# EAGLE design McPiFace-RGBPanel-V1 (EAGLE 7.4.0)
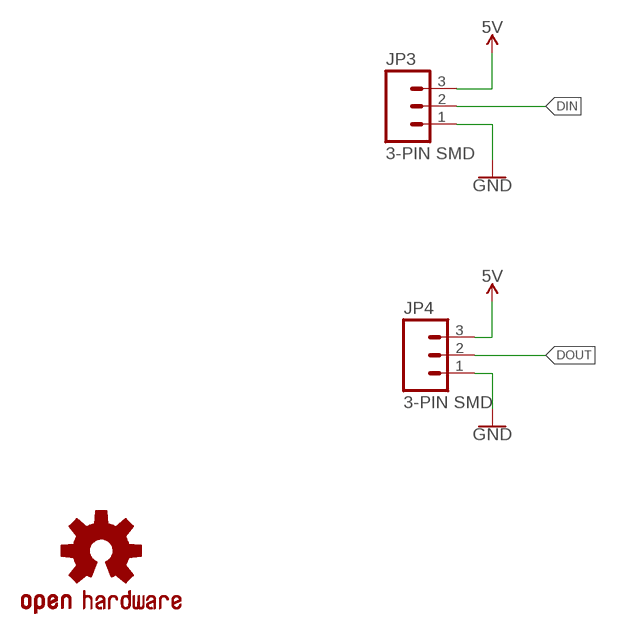
[diagram p0: schematic, sheet 1, part 1 of 2]
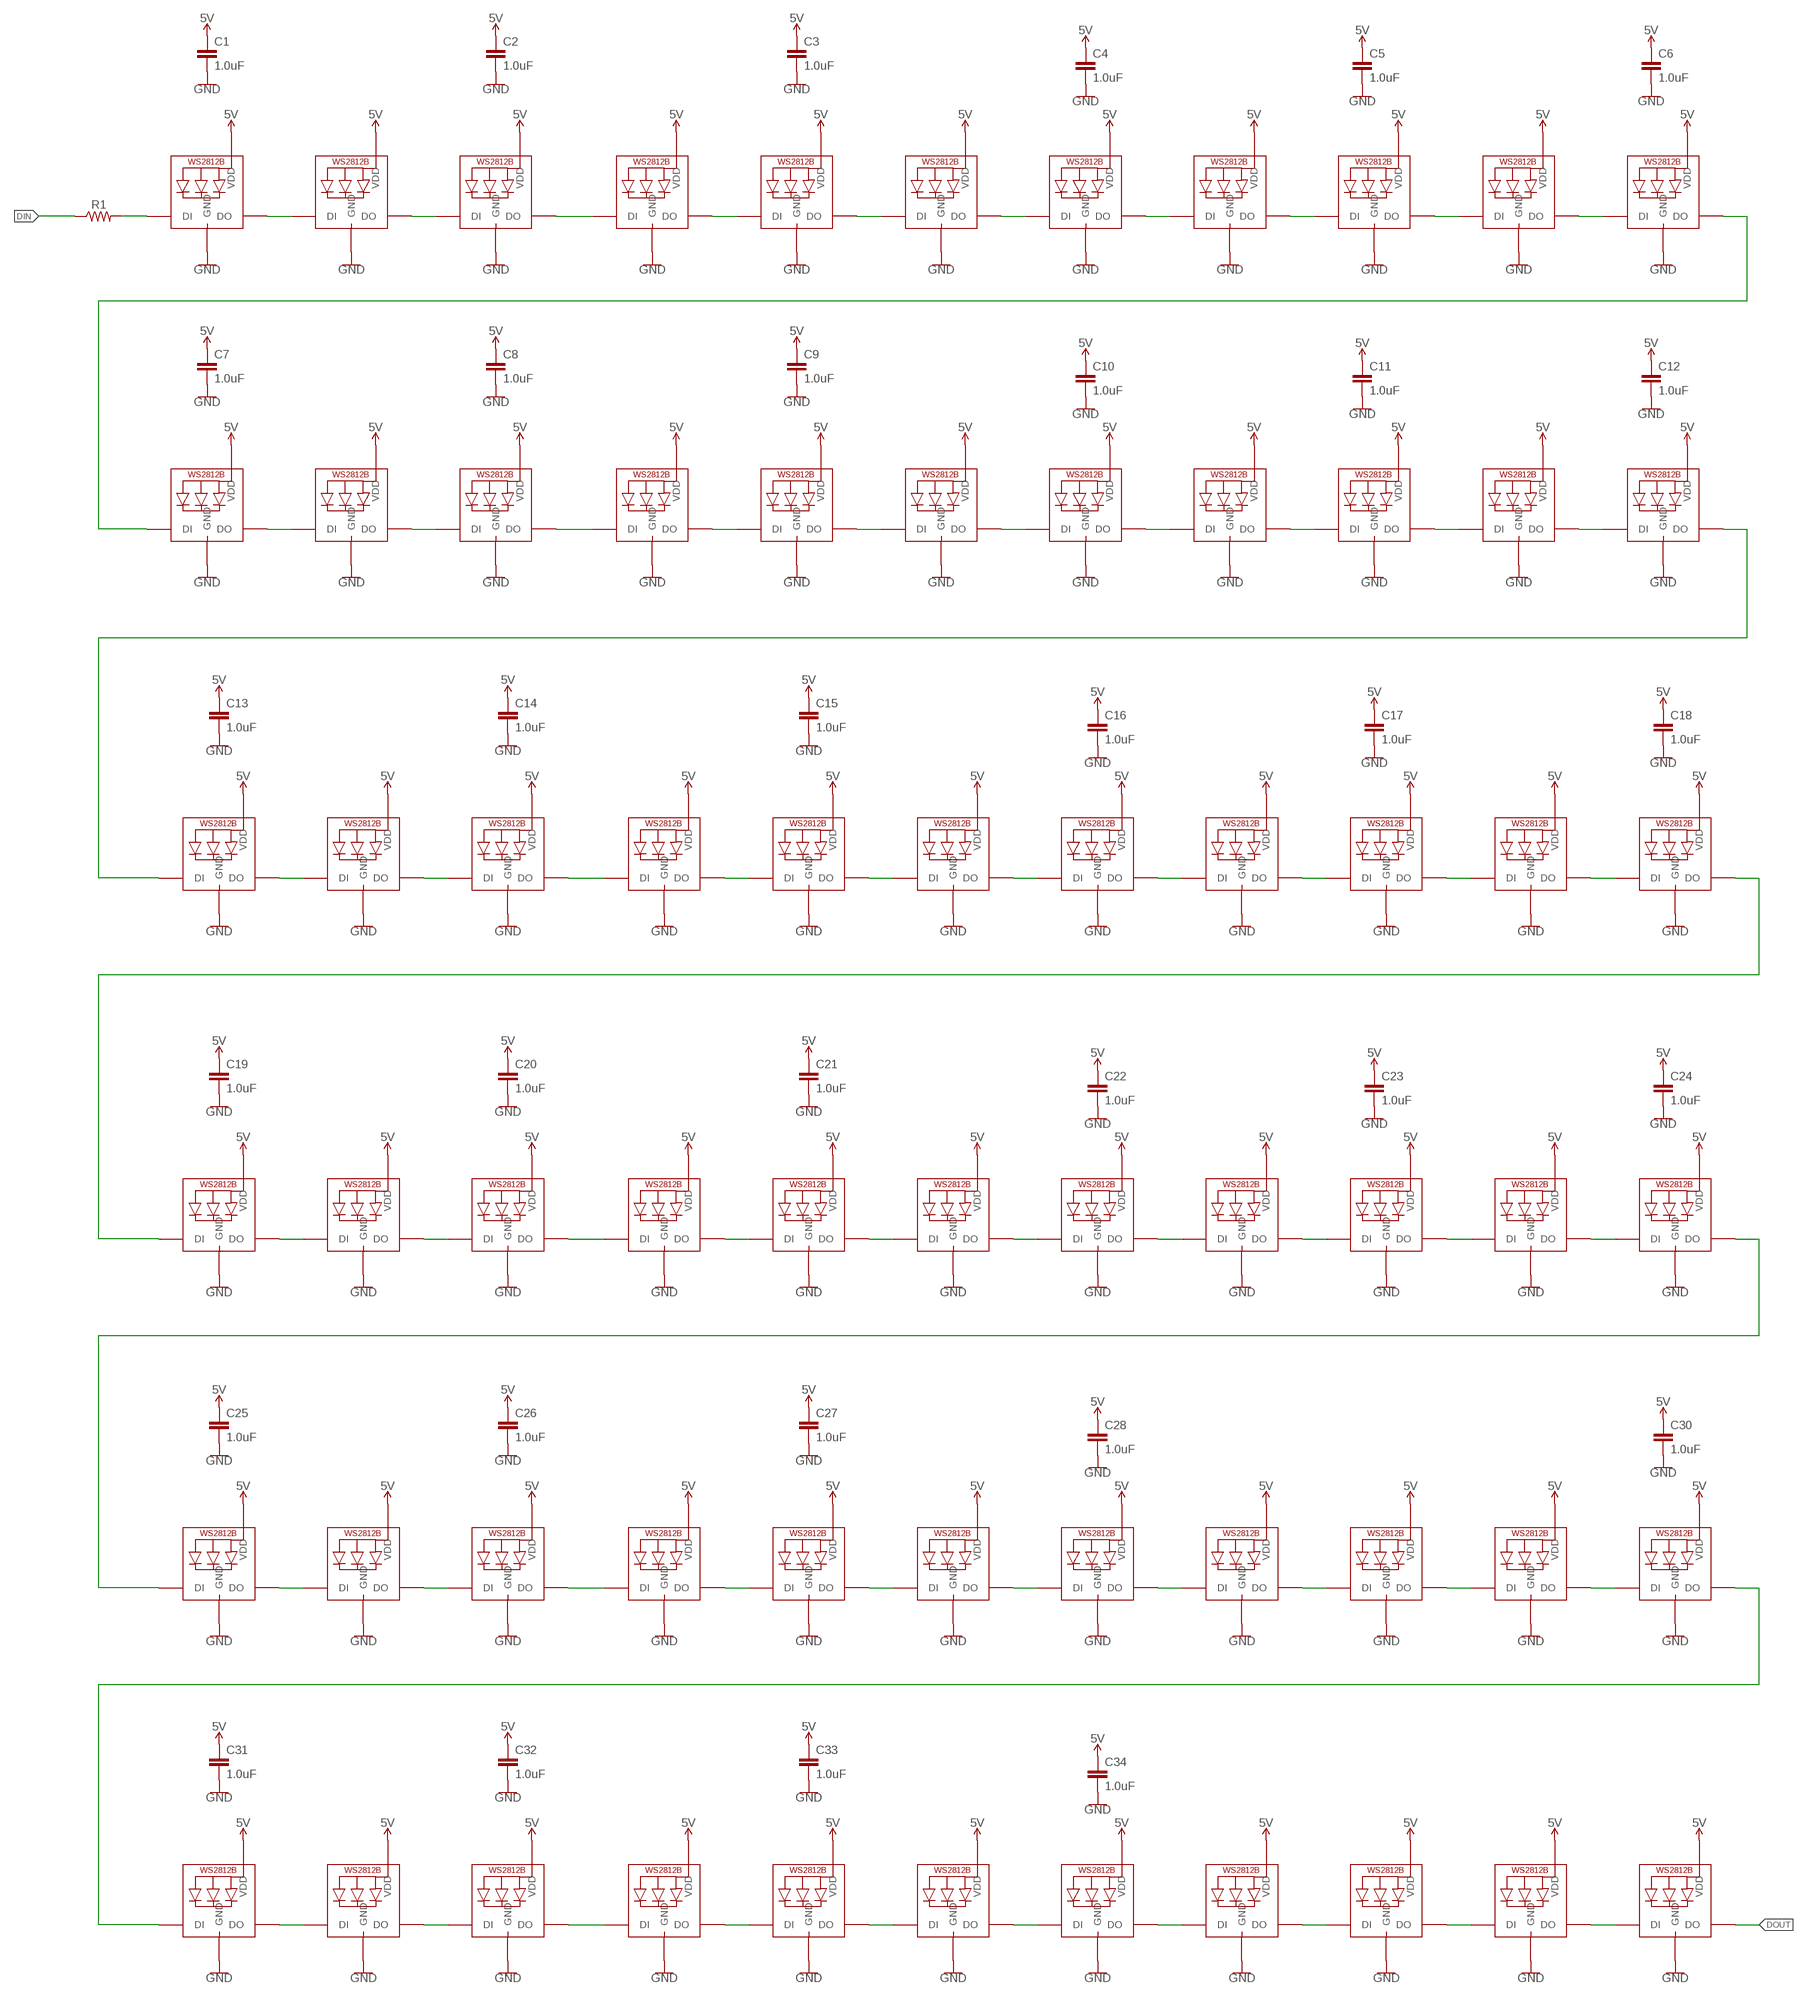
[diagram p1: schematic, sheet 1, part 2 of 2]

## Parts
C1  1.0uF  1.0UF-25V-+80/-20(0805)"  [0805-CAP]
C2  1.0uF  1.0UF-25V-+80/-20(0805)"  [0805-CAP]
C3  1.0uF  1.0UF-25V-+80/-20(0805)"  [0805-CAP]
C4  1.0uF  1.0UF-25V-+80/-20(0805)"  [0805-CAP]
C5  1.0uF  1.0UF-25V-+80/-20(0805)"  [0805-CAP]
C6  1.0uF  1.0UF-25V-+80/-20(0805)"  [0805-CAP]
C7  1.0uF  1.0UF-25V-+80/-20(0805)"  [0805-CAP]
C8  1.0uF  1.0UF-25V-+80/-20(0805)"  [0805-CAP]
C9  1.0uF  1.0UF-25V-+80/-20(0805)"  [0805-CAP]
C10  1.0uF  1.0UF-25V-+80/-20(0805)"  [0805-CAP]
C11  1.0uF  1.0UF-25V-+80/-20(0805)"  [0805-CAP]
C12  1.0uF  1.0UF-25V-+80/-20(0805)"  [0805-CAP]
C13  1.0uF  1.0UF-25V-+80/-20(0805)"  [0805-CAP]
C14  1.0uF  1.0UF-25V-+80/-20(0805)"  [0805-CAP]
C15  1.0uF  1.0UF-25V-+80/-20(0805)"  [0805-CAP]
C16  1.0uF  1.0UF-25V-+80/-20(0805)"  [0805-CAP]
C17  1.0uF  1.0UF-25V-+80/-20(0805)"  [0805-CAP]
C18  1.0uF  1.0UF-25V-+80/-20(0805)"  [0805-CAP]
C19  1.0uF  1.0UF-25V-+80/-20(0805)"  [0805-CAP]
C20  1.0uF  1.0UF-25V-+80/-20(0805)"  [0805-CAP]
C21  1.0uF  1.0UF-25V-+80/-20(0805)"  [0805-CAP]
C22  1.0uF  1.0UF-25V-+80/-20(0805)"  [0805-CAP]
C23  1.0uF  1.0UF-25V-+80/-20(0805)"  [0805-CAP]
C24  1.0uF  1.0UF-25V-+80/-20(0805)"  [0805-CAP]
C25  1.0uF  1.0UF-25V-+80/-20(0805)"  [0805-CAP]
C26  1.0uF  1.0UF-25V-+80/-20(0805)"  [0805-CAP]
C27  1.0uF  1.0UF-25V-+80/-20(0805)"  [0805-CAP]
C28  1.0uF  1.0UF-25V-+80/-20(0805)"  [0805-CAP]
C30  1.0uF  1.0UF-25V-+80/-20(0805)"  [0805-CAP]
C31  1.0uF  1.0UF-25V-+80/-20(0805)"  [0805-CAP]
C32  1.0uF  1.0UF-25V-+80/-20(0805)"  [0805-CAP]
C33  1.0uF  1.0UF-25V-+80/-20(0805)"  [0805-CAP]
C34  1.0uF  1.0UF-25V-+80/-20(0805)"  [0805-CAP]
JP3  3-PIN SMD  M03JST-SMD  [JST-3-SMD]
JP4  3-PIN SMD  M03JST-SMD  [JST-3-SMD]
LED1  WS2812B5050  [WS2812B]
LED2  WS2812B5050  [WS2812B]
LED3  WS2812B5050  [WS2812B]
LED4  WS2812B5050  [WS2812B]
LED5  WS2812B5050  [WS2812B]
LED6  WS2812B5050  [WS2812B]
LED7  WS2812B5050  [WS2812B]
LED8  WS2812B5050  [WS2812B]
LED9  WS2812B5050  [WS2812B]
LED10  WS2812B5050  [WS2812B]
LED11  WS2812B5050  [WS2812B]
LED12  WS2812B5050  [WS2812B]
LED13  WS2812B5050  [WS2812B]
LED14  WS2812B5050  [WS2812B]
LED15  WS2812B5050  [WS2812B]
LED16  WS2812B5050  [WS2812B]
LED17  WS2812B5050  [WS2812B]
LED18  WS2812B5050  [WS2812B]
LED19  WS2812B5050  [WS2812B]
LED20  WS2812B5050  [WS2812B]
LED21  WS2812B5050  [WS2812B]
LED22  WS2812B5050  [WS2812B]
LED23  WS2812B5050  [WS2812B]
LED24  WS2812B5050  [WS2812B]
LED25  WS2812B5050  [WS2812B]
LED26  WS2812B5050  [WS2812B]
LED27  WS2812B5050  [WS2812B]
LED28  WS2812B5050  [WS2812B]
LED29  WS2812B5050  [WS2812B]
LED30  WS2812B5050  [WS2812B]
LED31  WS2812B5050  [WS2812B]
LED32  WS2812B5050  [WS2812B]
LED33  WS2812B5050  [WS2812B]
LED34  WS2812B5050  [WS2812B]
LED35  WS2812B5050  [WS2812B]
LED36  WS2812B5050  [WS2812B]
LED37  WS2812B5050  [WS2812B]
LED38  WS2812B5050  [WS2812B]
LED39  WS2812B5050  [WS2812B]
LED40  WS2812B5050  [WS2812B]
LED41  WS2812B5050  [WS2812B]
LED42  WS2812B5050  [WS2812B]
LED43  WS2812B5050  [WS2812B]
LED44  WS2812B5050  [WS2812B]
LED45  WS2812B5050  [WS2812B]
LED46  WS2812B5050  [WS2812B]
LED47  WS2812B5050  [WS2812B]
LED48  WS2812B5050  [WS2812B]
LED49  WS2812B5050  [WS2812B]
LED50  WS2812B5050  [WS2812B]
LED51  WS2812B5050  [WS2812B]
LED52  WS2812B5050  [WS2812B]
LED53  WS2812B5050  [WS2812B]
LED54  WS2812B5050  [WS2812B]
LED55  WS2812B5050  [WS2812B]
LED56  WS2812B5050  [WS2812B]
LED57  WS2812B5050  [WS2812B]
LED58  WS2812B5050  [WS2812B]
LED59  WS2812B5050  [WS2812B]
LED60  WS2812B5050  [WS2812B]
LED61  WS2812B5050  [WS2812B]
LED62  WS2812B5050  [WS2812B]
LED63  WS2812B5050  [WS2812B]
LED64  WS2812B5050  [WS2812B]
LED65  WS2812B5050  [WS2812B]
LED66  WS2812B5050  [WS2812B]
LOGO1  OSHW-LOGOL  [OSHW-LOGO-L]
R1  RESISTOR0805  [0805]

## Nets
5V: C1.1 C2.1 C3.1 C4.1 C5.1 C6.1 C7.1 C8.1 C9.1 C10.1 C11.1 C12.1 C13.1 C14.1 C15.1 C16.1 C17.1 C18.1 C19.1 C20.1 C21.1 C22.1 C23.1 C24.1 C25.1 C26.1 C27.1 C28.1 C30.1 C31.1 C32.1 C33.1 C34.1 JP3.3 JP4.3 LED1.1-VDD(VDD) LED2.1-VDD(VDD) LED3.1-VDD(VDD) LED4.1-VDD(VDD) LED5.1-VDD(VDD) LED6.1-VDD(VDD) LED7.1-VDD(VDD) LED8.1-VDD(VDD) LED9.1-VDD(VDD) LED10.1-VDD(VDD) LED11.1-VDD(VDD) LED12.1-VDD(VDD) LED13.1-VDD(VDD) LED14.1-VDD(VDD) LED15.1-VDD(VDD) LED16.1-VDD(VDD) LED17.1-VDD(VDD) LED18.1-VDD(VDD) LED19.1-VDD(VDD) LED20.1-VDD(VDD) LED21.1-VDD(VDD) LED22.1-VDD(VDD) LED23.1-VDD(VDD) LED24.1-VDD(VDD) LED25.1-VDD(VDD) LED26.1-VDD(VDD) LED27.1-VDD(VDD) LED28.1-VDD(VDD) LED29.1-VDD(VDD) LED30.1-VDD(VDD) LED31.1-VDD(VDD) LED32.1-VDD(VDD) LED33.1-VDD(VDD) LED34.1-VDD(VDD) LED35.1-VDD(VDD) LED36.1-VDD(VDD) LED37.1-VDD(VDD) LED38.1-VDD(VDD) LED39.1-VDD(VDD) LED40.1-VDD(VDD) LED41.1-VDD(VDD) LED42.1-VDD(VDD) LED43.1-VDD(VDD) LED44.1-VDD(VDD) LED45.1-VDD(VDD) LED46.1-VDD(VDD) LED47.1-VDD(VDD) LED48.1-VDD(VDD) LED49.1-VDD(VDD) LED50.1-VDD(VDD) LED51.1-VDD(VDD) LED52.1-VDD(VDD) LED53.1-VDD(VDD) LED54.1-VDD(VDD) LED55.1-VDD(VDD) LED56.1-VDD(VDD) LED57.1-VDD(VDD) LED58.1-VDD(VDD) LED59.1-VDD(VDD) LED60.1-VDD(VDD) LED61.1-VDD(VDD) LED62.1-VDD(VDD) LED63.1-VDD(VDD) LED64.1-VDD(VDD) LED65.1-VDD(VDD) LED66.1-VDD(VDD)
DIN: JP3.2 R1.1
DOUT: JP4.2 LED66.2-DOUT(DO)
GND: C1.2 C2.2 C3.2 C4.2 C5.2 C6.2 C7.2 C8.2 C9.2 C10.2 C11.2 C12.2 C13.2 C14.2 C15.2 C16.2 C17.2 C18.2 C19.2 C20.2 C21.2 C22.2 C23.2 C24.2 C25.2 C26.2 C27.2 C28.2 C30.2 C31.2 C32.2 C33.2 C34.2 JP3.1 JP4.1 LED1.3-GND(GND) LED2.3-GND(GND) LED3.3-GND(GND) LED4.3-GND(GND) LED5.3-GND(GND) LED6.3-GND(GND) LED7.3-GND(GND) LED8.3-GND(GND) LED9.3-GND(GND) LED10.3-GND(GND) LED11.3-GND(GND) LED12.3-GND(GND) LED13.3-GND(GND) LED14.3-GND(GND) LED15.3-GND(GND) LED16.3-GND(GND) LED17.3-GND(GND) LED18.3-GND(GND) LED19.3-GND(GND) LED20.3-GND(GND) LED21.3-GND(GND) LED22.3-GND(GND) LED23.3-GND(GND) LED24.3-GND(GND) LED25.3-GND(GND) LED26.3-GND(GND) LED27.3-GND(GND) LED28.3-GND(GND) LED29.3-GND(GND) LED30.3-GND(GND) LED31.3-GND(GND) LED32.3-GND(GND) LED33.3-GND(GND) LED34.3-GND(GND) LED35.3-GND(GND) LED36.3-GND(GND) LED37.3-GND(GND) LED38.3-GND(GND) LED39.3-GND(GND) LED40.3-GND(GND) LED41.3-GND(GND) LED42.3-GND(GND) LED43.3-GND(GND) LED44.3-GND(GND) LED45.3-GND(GND) LED46.3-GND(GND) LED47.3-GND(GND) LED48.3-GND(GND) LED49.3-GND(GND) LED50.3-GND(GND) LED51.3-GND(GND) LED52.3-GND(GND) LED53.3-GND(GND) LED54.3-GND(GND) LED55.3-GND(GND) LED56.3-GND(GND) LED57.3-GND(GND) LED58.3-GND(GND) LED59.3-GND(GND) LED60.3-GND(GND) LED61.3-GND(GND) LED62.3-GND(GND) LED63.3-GND(GND) LED64.3-GND(GND) LED65.3-GND(GND) LED66.3-GND(GND)
N$1: LED1.2-DOUT(DO) LED2.4-DIN(DI)
N$2: LED11.2-DOUT(DO) LED12.4-DIN(DI)
N$3: LED12.2-DOUT(DO) LED13.4-DIN(DI)
N$4: LED13.2-DOUT(DO) LED14.4-DIN(DI)
N$5: LED1.4-DIN(DI) R1.2
N$6: LED14.2-DOUT(DO) LED15.4-DIN(DI)
N$7: LED15.2-DOUT(DO) LED16.4-DIN(DI)
N$8: LED2.2-DOUT(DO) LED3.4-DIN(DI)
N$9: LED3.2-DOUT(DO) LED4.4-DIN(DI)
N$10: LED16.2-DOUT(DO) LED17.4-DIN(DI)
N$11: LED4.2-DOUT(DO) LED5.4-DIN(DI)
N$12: LED5.2-DOUT(DO) LED6.4-DIN(DI)
N$13: LED6.2-DOUT(DO) LED7.4-DIN(DI)
N$14: LED7.2-DOUT(DO) LED8.4-DIN(DI)
N$15: LED8.2-DOUT(DO) LED9.4-DIN(DI)
N$16: LED9.2-DOUT(DO) LED10.4-DIN(DI)
N$17: LED10.2-DOUT(DO) LED11.4-DIN(DI)
N$18: LED17.2-DOUT(DO) LED18.4-DIN(DI)
N$19: LED18.2-DOUT(DO) LED19.4-DIN(DI)
N$20: LED19.2-DOUT(DO) LED20.4-DIN(DI)
N$21: LED20.2-DOUT(DO) LED21.4-DIN(DI)
N$22: LED21.2-DOUT(DO) LED22.4-DIN(DI)
N$24: LED22.2-DOUT(DO) LED23.4-DIN(DI)
N$25: LED23.2-DOUT(DO) LED24.4-DIN(DI)
N$26: LED24.2-DOUT(DO) LED25.4-DIN(DI)
N$27: LED25.2-DOUT(DO) LED26.4-DIN(DI)
N$28: LED26.2-DOUT(DO) LED27.4-DIN(DI)
N$29: LED27.2-DOUT(DO) LED28.4-DIN(DI)
N$30: LED28.2-DOUT(DO) LED29.4-DIN(DI)
N$31: LED29.2-DOUT(DO) LED30.4-DIN(DI)
N$32: LED30.2-DOUT(DO) LED31.4-DIN(DI)
N$33: LED31.2-DOUT(DO) LED32.4-DIN(DI)
N$34: LED32.2-DOUT(DO) LED33.4-DIN(DI)
N$35: LED33.2-DOUT(DO) LED34.4-DIN(DI)
N$37: LED34.2-DOUT(DO) LED35.4-DIN(DI)
N$38: LED35.2-DOUT(DO) LED36.4-DIN(DI)
N$39: LED36.2-DOUT(DO) LED37.4-DIN(DI)
N$40: LED37.2-DOUT(DO) LED38.4-DIN(DI)
N$41: LED38.2-DOUT(DO) LED39.4-DIN(DI)
N$42: LED39.2-DOUT(DO) LED40.4-DIN(DI)
N$43: LED40.2-DOUT(DO) LED41.4-DIN(DI)
N$44: LED41.2-DOUT(DO) LED42.4-DIN(DI)
N$45: LED42.2-DOUT(DO) LED43.4-DIN(DI)
N$46: LED43.2-DOUT(DO) LED44.4-DIN(DI)
N$49: LED44.2-DOUT(DO) LED45.4-DIN(DI)
N$50: LED45.2-DOUT(DO) LED46.4-DIN(DI)
N$51: LED46.2-DOUT(DO) LED47.4-DIN(DI)
N$52: LED47.2-DOUT(DO) LED48.4-DIN(DI)
N$53: LED48.2-DOUT(DO) LED49.4-DIN(DI)
N$54: LED49.2-DOUT(DO) LED50.4-DIN(DI)
N$55: LED50.2-DOUT(DO) LED51.4-DIN(DI)
N$56: LED51.2-DOUT(DO) LED52.4-DIN(DI)
N$57: LED52.2-DOUT(DO) LED53.4-DIN(DI)
N$58: LED53.2-DOUT(DO) LED54.4-DIN(DI)
N$59: LED54.2-DOUT(DO) LED55.4-DIN(DI)
N$61: LED55.2-DOUT(DO) LED56.4-DIN(DI)
N$62: LED56.2-DOUT(DO) LED57.4-DIN(DI)
N$63: LED57.2-DOUT(DO) LED58.4-DIN(DI)
N$64: LED58.2-DOUT(DO) LED59.4-DIN(DI)
N$65: LED59.2-DOUT(DO) LED60.4-DIN(DI)
N$66: LED60.2-DOUT(DO) LED61.4-DIN(DI)
N$67: LED61.2-DOUT(DO) LED62.4-DIN(DI)
N$68: LED62.2-DOUT(DO) LED63.4-DIN(DI)
N$69: LED63.2-DOUT(DO) LED64.4-DIN(DI)
N$70: LED64.2-DOUT(DO) LED65.4-DIN(DI)
N$71: LED65.2-DOUT(DO) LED66.4-DIN(DI)

## Library data of the parts
C1-C28 C30-C34 = SparkFun-Capacitors:1.0UF-25V-+80/-20(0805): CAP-11625; PROD_ID: CAP-11625
JP3 JP4 = SparkFun-Connectors:M03: Header 3 Standard 3-pin 0.1" header. Use with straight break away headers (SKU : PRT-00116), right angle break away headers (PRT-00553), swiss pins (PRT-00743), machine pins (PRT-00117), and female headers (PRT-00115). Molex polarized connector foot print use with SKU : PRT-08232 with associated crimp pins and housings.; PROD_ID: CONN-12591
LED1-LED66 = ThingySticks:WS2812B
LOGO1 = SparkFun-Aesthetics:OSHW-LOGO: Open-Source Hardware (OSHW) Logo This logo indicates the piece of hardware it is found on incorporates a OSHW license and/or adheres to the definition of open source hardware found here: http://freedomdefined.org/OSHW
R1 = SparkFun-Resistors:RESISTOR: Generic Resistor Package

## Board
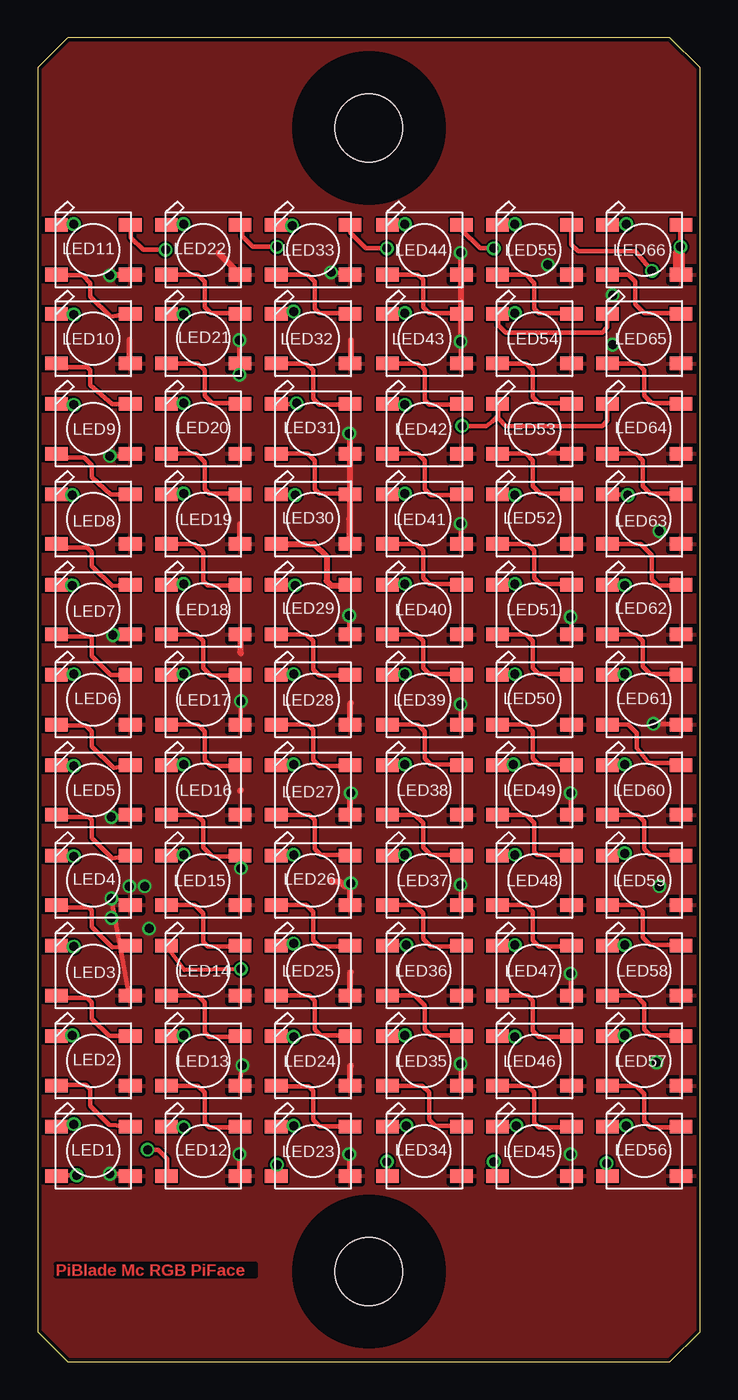
[diagram p2: board, top side]
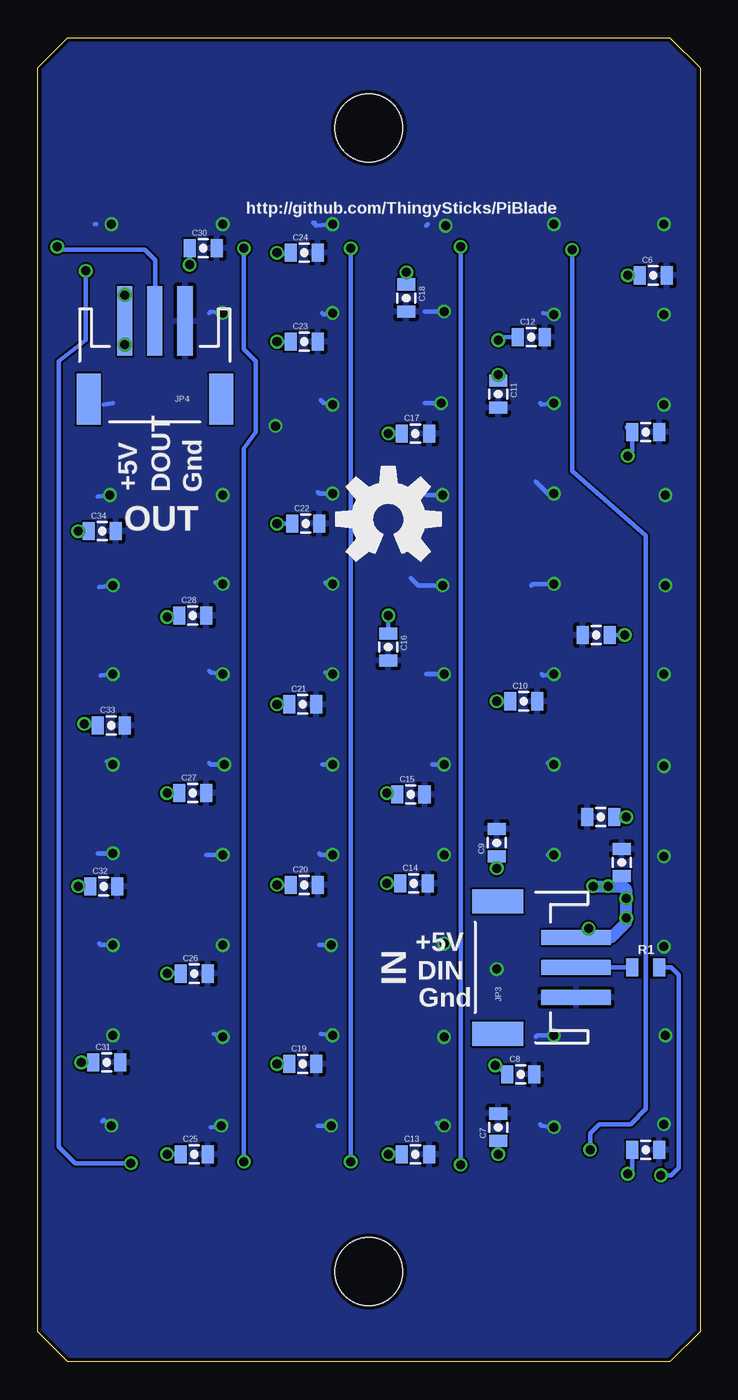
[diagram p3: board, bottom side, seen from below]

Size 44 x 88 mm. Coordinates in mm from the lower left corner, seen from the top.
Outline: 2,0 42,0 44,2 44,86 42,88 2,88 0,86 0,2 2,0
Copper layers (1*16): Top 0.035mm / dielectric 1.5mm / Bottom 0.035mm
Design rules "dirt_cheap_dirty_boards.v1": minimum track width 5mil, minimum drill 12mil, track to track 5mil, track to pad 5mil, pad to pad 5mil, via to via 5mil, smd to smd 0mil, copper to edge 10mil, drill to drill 10mil, minimum pad ring 10mil, minimum via ring 6mil, stop-mask expansion 2mil, vias tented up to drill 25mil, thermal gap 10mil
Holes 4.5 mm at 22,6 22,82
tRestrict: area 17,77 to 27,87; area 17,1 to 27,11

### Footprints (pad centres in the part's own frame; a part is rotated, then mirrored left to right if it is on the bottom)
0805-CAP = smd 0.8 x 1.2: 1 -0.9,0; 2 0.9,0
JST-3-SMD = smd 1 x 4.6: 1 -1.99,-4.77; 2 0.01,-4.77; 3 2.01,-4.77 | smd 1.6 x 3.4: NC1 -4.39,0.43; NC2 4.41,0.43
WS2812B = smd 1.5 x 0.9: 1-VDD 2.45,-1.65; 2-DOUT 2.45,1.65; 3-GND -2.45,1.65; 4-DIN -2.45,-1.65
0805 = smd 0.8 x 1.2: 1 -0.9,0; 2 0.9,0

### Placement (x,y rotation side)
C1  3.6,14.1 0 bottom
C2  5.2,33.2 90 bottom
C3  6.6,36.2 180 bottom
C4  6.9,48.3 180 bottom
C5  3.6,61.8 0 bottom
C6  3.1,72.2 0 bottom
C7  13.4,15.6 90 bottom
C8  11.9,19.1 0 bottom
C9  13.5,34.5 90 bottom
C10  11.7,43.9 0 bottom
C11  13.4,64.3 270 bottom
C12  11.2,68.1 0 bottom
C13  18.9,13.8 0 bottom
C14  19,31.8 0 bottom
C15  19.2,37.7 0 bottom
C16  20.7,47.5 270 bottom
C17  18.9,61.7 0 bottom
C18  19.5,70.7 270 bottom
C19  26.4,19.8 0 bottom
C20  26.3,31.7 0 bottom
C21  26.4,43.7 0 bottom
C22  26.2,55.7 0 bottom
C23  26.3,67.8 0 bottom
C24  26.3,73.7 0 bottom
C25  33.6,13.8 0 bottom
C26  33.6,25.8 0 bottom
C27  33.7,37.8 0 bottom
C28  33.7,49.6 0 bottom
C30  33,74 0 bottom
C31  39.4,19.9 0 bottom
C32  39.6,31.6 0 bottom
C33  39.1,42.3 0 bottom
C34  39.7,55.2 0 bottom
JP3  13,26.2 90 bottom
JP4  36.2,64.4 180 bottom
LED1  3.7,14 0 top
LED2  3.7,20 0 top
LED3  3.7,26 0 top
LED4  3.7,32 0 top
LED5  3.7,38 0 top
LED6  3.7,44 0 top
LED7  3.7,50 0 top
LED8  3.7,56 0 top
LED9  3.7,62 0 top
LED10  3.7,68 0 top
LED11  3.7,73.9 0 top
LED12  11,14 0 top
LED13  11,20 0 top
LED14  11,26 0 top
LED15  11,32 0 top
LED16  11,38 0 top
LED17  11,44 0 top
LED18  11,50 0 top
LED19  11,56 0 top
LED20  11,62 0 top
LED21  11,68 0 top
LED22  11,73.9 0 top
LED23  18.3,14 0 top
LED24  18.3,20 0 top
LED25  18.3,26 0 top
LED26  18.3,32 0 top
LED27  18.3,38 0 top
LED28  18.3,44 0 top
LED29  18.3,50 0 top
LED30  18.3,56 0 top
LED31  18.3,62 0 top
LED32  18.3,68 0 top
LED33  18.3,73.9 0 top
LED34  25.7,14 0 top
LED35  25.7,20 0 top
LED36  25.7,26 0 top
LED37  25.7,32 0 top
LED38  25.7,38 0 top
LED39  25.7,44 0 top
LED40  25.7,50 0 top
LED41  25.7,56 0 top
LED42  25.7,62 0 top
LED43  25.7,68 0 top
LED44  25.7,73.9 0 top
LED45  33,14 0 top
LED46  33,20 0 top
LED47  33,26 0 top
LED48  33,32 0 top
LED49  33,38 0 top
LED50  33,44 0 top
LED51  33,50 0 top
LED52  33,56 0 top
LED53  33,62 0 top
LED54  33,68 0 top
LED55  33,73.9 0 top
LED56  40.3,14 0 top
LED57  40.3,20 0 top
LED58  40.3,26 0 top
LED59  40.3,32 0 top
LED60  40.3,38 0 top
LED61  40.3,44 0 top
LED62  40.3,50 0 top
LED63  40.3,56 0 top
LED64  40.3,62 0 top
LED65  40.3,68 0 top
LED66  40.3,73.9 0 top
LOGO1  20.7,56 0 bottom
R1  3.6,26.2 0 bottom

### Tracks (layer width: path | path; a pad name or v marks a point on that pad's centre or on a via)
5V  (via drill 0.6)
  Top 0.305: 6.1,72.2 LED11.1-VDD | v4.8,60.2 6.1,60.2 LED9.1-VDD | v5,48.3 6.1,48.3 LED7.1-VDD | v4.9,36.2 6.1,36.2 LED5.1-VDD | v4.9,30.8 6.1,24.3 LED3.1-VDD | v4.8,12.5 6,12.5 LED1.1-VDD | v13.6,19.7 13.4,18.4 LED13.1-VDD | v13.4,13.8 13.4,12.4 LED12.1-VDD | 13.4,30.4 LED15.1-VDD | v13.5,43.9 13.5,42.4 LED17.1-VDD | 13.4,55.7 13.4,54.4 LED19.1-VDD | v20.7,13.8 20.7,12.4 LED23.1-VDD | 20.7,25.8 20.7,24.4 LED25.1-VDD | v20.8,37.8 20.8,36.4 LED27.1-VDD | v20.7,49.6 C16.1 LED29.1-VDD | v20.7,61.7 20.7,60.4 LED31.1-VDD | v19.5,72.4 20.8,72.3 LED33.1-VDD | v28.1,73.7 28.1,72.3 LED44.1-VDD | v28.1,31.7 28.1,30.4 LED37.1-VDD | v28.1,43.7 28.1,42.4 LED39.1-VDD | v28.1,55.7 28.1,54.4 LED41.1-VDD | v28.1,67.8 28.1,66.4 LED43.1-VDD | 34,60.4 35.4,60.4 LED53.1-VDD | v35.4,49.5 35.5,48.4 LED51.1-VDD | v35.4,37.8 35.4,36.4 LED49.1-VDD | v35.4,25.8 35.4,24.4 LED47.1-VDD | 35.4,12.4 LED45.1-VDD | 42.8,54.4 LED63.1-VDD | 42.7,66.4 LED65.1-VDD | 42.8,18.4 LED57.1-VDD | 42.8,30.4 LED59.1-VDD | v40.9,42.4 42.7,42.4 LED61.1-VDD | v28.1,19.8 28.1,18.4 LED35.1-VDD | v13.4,67.9 13.4,66.4 LED21.1-VDD 13.4,66.3 v13.4,65.6
  Top 0.406: 6.1,72.2 v4.8,72.2 | 6.1,67.9 6.1,66.4 LED10.1-VDD | 12,73.7 LED22.1-VDD | LED44.1-VDD 28.15,73.65 v28.1,73.7 v28.1,67.8 | LED28.1-VDD 20.75,43.75 20.8,43.8 | LED27.1-VDD 20.75,37.75 v20.8,37.8 | LED24.1-VDD 20.75,19.65 20.8,19.7 | LED25.1-VDD 20.75,25.85 20.8,25.9 | 19.5,32 19.6,31.9 20.1,31.9 20.4,31.6 20.8,31.6 20.75,31.55 LED26.1-VDD 20.75,31.75 v20.8,31.8 | 13.45,37.95 13.5,38 | LED18.1-VDD 13.45,47.15 13.5,47.1 | 20.7,56 20.7,54.4 LED30.1-VDD 20.75,61.65 v20.7,61.7 | 20.8,67.9 20.8,66.4 LED32.1-VDD
  Top 0.813: 42.6,73.7 42.6,72.4 LED66.1-VDD
  Bottom 0.305: C6.1 v4.8,72.2 | C5.1 4.5,60.5 v4.8,60.2 | C4.1 v5,48.3 | C3.1 v4.9,36.2 | C1.1 4.5,12.7 v4.8,12.5 | C8.1 v13.6,19.7 | C7.1 v13.4,13.8 | C9.1 v13.5,32.8 | C10.1 v13.5,43.9 | C13.1 20.4,13.9 v20.7,13.8 | C15.1 20.6,37.8 v20.8,37.8 | C16.1 v20.7,49.6 | C17.1 v20.7,61.7 | C18.1 v19.5,72.4 | C24.1 27.7,73.6 v28.1,73.7 | C30.1 v33.9,72.9 | C20.1 v28.1,31.7 | C21.1 27.8,43.6 v28.1,43.7 | C22.1 v28.1,55.7 | C23.1 v28.1,67.8 | C28.1 35.2,49.5 v35.4,49.5 | C27.1 v35.4,37.8 | C26.1 v35.4,25.8 | C25.1 v35.4,13.8 | C31.1 v41.1,19.9 | C32.1 v41.3,31.6 | C33.1 40.9,42.3 v40.9,42.4 | C19.1 v28.1,19.8 | C12.1 13.2,68.1 v13.4,67.9 | C34.1 v41.3,55.2 | C11.1 v13.4,65.6
  Bottom 0.406: 4.8,62.1 C5.1 | v20.8,31.8 C14.1 19.7,31.8 | v4.9,30.8 4.9,30.9 | 4.9,31.4 C2.1
  Bottom 0.813: JP3.3 5.89,28.21 4.9,29.2 v4.9,30.8 | v7.1,31.6 5.1,31.6 4.9,31.4 4.9,30.9 | v38.2,70.9 JP4.3
  other vias: 4.9,29.5 6.1,31.6 7.4,28.8 38.2,67.6
  pour Top: -1,88.5 45,88.5 45,-1 -1,-1
DIN
  Bottom 0.305: R1.1 8.62,26.2 JP3.2
DOUT  (via drill 0.6)
  Top 0.305: 42.7,75.6 LED66.2-DOUT 42.7,75.5 v42.7,74.1
  Bottom 0.305: JP4.2 36.21,70.1 | 36.21,70.1 36.2,71 36.2,73.2 36.9,73.9 42.5,73.9 v42.7,74.1 | 36.2,70.1 36.21,70.1
GND  (via drill 0.6)
  Top 0.305: LED22.3-GND 9.65,75.55 v9.7,75.6 | LED21.3-GND 9.65,69.75 v9.7,69.6 | LED20.3-GND 9.75,63.65 v9.7,63.7 | LED19.3-GND 9.85,57.65 v9.7,57.7 | LED18.3-GND 9.65,51.65 v9.7,51.7 | LED17.3-GND 9.85,45.65 v9.7,45.7 | LED16.3-GND 9.65,39.65 v9.7,39.7 | LED15.3-GND 9.55,33.65 v9.7,33.7 | LED14.3-GND 9.75,26.05 v13.5,26.1 | LED13.3-GND 9.65,21.65 v9.7,21.7 | LED12.3-GND 9.35,15.65 v9.7,15.6 | LED32.3-GND 16.95,69.75 v17,69.8 | LED31.3-GND 17.15,63.65 v17.2,63.7 | LED30.3-GND 17.15,57.65 v17.1,57.6 | LED29.3-GND 17.35,51.65 v17.1,51.6 | LED28.3-GND 16.75,45.65 v17,45.7 | LED27.3-GND 16.95,39.65 v17,39.7 | LED26.3-GND 17.05,33.65 v17,33.7 | LED25.3-GND 16.95,27.75 v17,27.8 | LED24.3-GND 16.95,21.65 v17,21.6 | LED23.3-GND 16.95,15.75 v17,15.7 | LED44.3-GND 24.35,75.55 v24.4,75.6 | LED43.3-GND 24.35,69.65 v24.4,69.7 | LED42.3-GND 24.05,63.65 v24.4,63.6 | LED41.3-GND 24.45,57.65 v24.4,57.7 | LED40.3-GND 24.45,51.75 v24.4,51.7 | LED39.3-GND 24.25,45.65 v24.4,45.7 | LED38.3-GND 24.35,39.65 v24.4,39.7 | LED37.3-GND 24.35,33.65 v24.4,33.7 | LED36.3-GND 24.45,27.75 v24.5,27.7 | LED35.3-GND 24.25,21.75 v24.4,21.7 | LED34.3-GND 24.35,15.65 v24.5,15.7 | LED45.3-GND 31.55,15.65 v31.8,15.7 | LED46.3-GND 31.55,21.65 v31.7,21.6 | LED47.3-GND 31.55,27.65 v31.7,27.7 | LED48.3-GND 31.75,33.65 v31.7,33.7 | LED49.3-GND 31.55,39.75 v31.6,39.7 | LED50.3-GND 31.45,45.65 v31.7,45.7 | LED51.3-GND 31.55,51.65 v31.7,51.7 | LED52.3-GND 31.65,57.75 v31.7,57.6 | v31.7,69.7 31.65,69.65 LED54.3-GND 30.6,69.6 30.6,68.9 31.1,68.4 37.5,68.4 37.85,68.75 LED65.3-GND | LED55.3-GND 31.75,75.55 v31.7,75.6 | LED66.3-GND 38.85,75.65 v39.1,75.6 | LED63.3-GND 38.95,57.65 v39.2,57.6
  Top 0.305: LED62.3-GND 38.75,51.65 v39,51.6 | v39,45.7 38.65,45.65 LED61.3-GND | LED60.3-GND 38.85,39.65 v39,39.7 | LED59.3-GND 38.95,33.85 v39,33.8 | LED58.3-GND 38.95,27.75 v39,27.7 | LED57.3-GND 38.85,21.65 v39,21.7 | LED56.3-GND 38.55,15.65 v39.1,15.7 | LED33.3-GND 16.85,75.55 v16.9,75.5 | LED64.3-GND 37.85,62.55 37.5,62.2 31.1,62.2 30.6,62.7 30.6,63.6 LED53.3-GND 30.55,62.85 30.2,62.5 29.8,62.2 v28.2,62.2
  Top 0.406: v2.4,15.8 1.2,15.8 LED1.3-GND | v2.3,21.7 1.4,21.7 LED2.3-GND | v2.4,27.6 1.5,27.5 LED3.3-GND | v2.4,33.6 1.5,33.5 LED4.3-GND | v2.4,39.6 1.4,39.5 LED5.3-GND | v2.4,45.7 1.5,45.7 LED6.3-GND | v2.3,51.6 1.4,51.6 LED7.3-GND | v2.3,57.6 1.5,57.5 LED8.3-GND | v2.4,63.6 1.5,63.5 LED9.3-GND | v2.4,69.6 1.4,69.5 LED10.3-GND | v2.4,75.6 1.3,75.5 LED11.3-GND
  Bottom 0.305: v9.7,75.6 9.9,75.5 10,75.6 | v9.7,69.6 10.4,69.7 | v9.7,63.7 10.5,63.6 10.6,63.7 | v9.7,57.7 10,57.6 10.9,58.5 | v9.7,51.7 11.1,51.7 11.2,51.6 | v9.7,45.7 10.4,45.6 10.5,45.7 | v9.7,39.7 10,39.7 10.1,39.8 | v9.7,33.7 10.1,33.7 | v9.7,21.7 10.8,21.7 10.9,21.6 | v9.7,15.6 10.5,15.7 10.6,15.8 | 18.1,75.6 18.2,75.5 | v17,69.8 18.3,69.8 | v17.2,63.7 18.3,63.7 | v17.1,57.6 18.2,57.6 | v17.1,51.6 18.7,51.6 19.2,52.1 | v17,45.7 18.2,45.7 | v17,39.7 17.8,39.7 | v17,33.7 17.3,33.8 | v17,27.8 17.3,27.8 17.4,27.9 | v17,21.6 17.2,21.9 | v17,15.7 17.3,15.7 17.5,15.9 | v24.4,75.6 25.5,75.5 25.7,75.7 25.6,75.7 | v24.4,69.7 25,69.6 25.1,69.7 | v24.4,63.6 25,63.7 25.2,63.9 | v24.4,57.7 25.3,57.7 25.4,57.8 | v24.4,51.7 24.8,51.7 24.9,51.8 | v24.4,45.7 24.9,45.8 | v24.4,39.7 25.1,39.7 | v24.4,33.7 25.2,33.7 25.3,33.8 | v24.5,27.7 25.3,27.7 | v24.4,21.7 25.2,21.8 | v24.5,15.7 25.4,15.7 | v31.8,15.7 32.5,15.6 | v31.7,21.6 32.3,21.8 | 31.81,27.89 v31.7,27.7 | v31.7,33.7 32.8,33.7 | v31.6,39.7 32.5,39.7 32.6,39.8 | v31.7,45.7 32.5,45.8 32.6,45.9 | v31.7,51.7 32.2,51.8 | v31.7,57.6 31.9,57.8 | v31.7,69.7 32.5,69.8 32.6,69.7 | 40.2,75.6 40.1,75.6 | 39,63.7 39.6,63.6 | v39.2,57.6 40,57.5 | v39,51.6 39.9,51.5 | v39,45.7 39.8,45.6 | v39,39.7 39.4,39.9 | v39,33.8 40,33.8 | v39,27.7 39.8,27.7 39.9,27.8 | 38.9,21.6 v39,21.7 | v39.1,15.7 39.6,16.1 39.7,16
  pour Bottom: -1,88.5 45,88.5 45,-1 -1,-1
N$1
  Top 0.305: LED1.2-DOUT 4.75,15.75 3.5,17 3.5,18.1 3.2,18.4 1.3,18.4 LED2.4-DIN
N$2  (via drill 0.6)
  Top 0.305: LED11.2-DOUT 6.2,75.5 6.2,74.7 7,73.9 v8.5,73.9 | v7.3,14.1 8,14.1 8.6,13.5 8.6,12.4 LED12.4-DIN
  Bottom 0.305: v8.5,73.9 8.5,59.2 3.6,54.9 3.6,16.8 4.6,15.8 6.7,15.8 7.3,15.2 v7.3,14.1
N$3
  Top 0.305: LED13.4-DIN 10.65,18.35 11.1,17.9 11.1,15.9 11.4,15.6 13.4,15.6 LED12.2-DOUT
N$4
  Top 0.305: LED14.4-DIN 10.65,24.35 11.1,23.9 11.1,21.9 11.4,21.6 13.4,21.6 LED13.2-DOUT
N$5  (via drill 0.6)
  Top 0.305: v2.6,12.4 1.2,12.4 LED1.4-DIN
  Bottom 0.305: v2.6,12.4 1.9,12.4 1.4,12.9 1.4,25.7 1.9,26.2 R1.2
N$6
  Top 0.305: LED15.4-DIN 10.45,30.35 11,29.8 11,27.9 11.3,27.6 13.4,27.6 LED14.2-DOUT
N$7
  Top 0.305: LED16.4-DIN 10.55,36.35 11,35.9 11,34.2 11.6,33.6 13.4,33.6 LED15.2-DOUT
N$8
  Top 0.305: LED2.2-DOUT 4.75,21.65 3.6,22.8 3.6,23.9 3.3,24.2 1.3,24.2 LED3.4-DIN
N$9
  Top 0.305: LED3.2-DOUT 4.95,27.55 3.6,28.9 3.6,30 3.4,30.2 1.3,30.2 LED4.4-DIN
N$10
  Top 0.305: LED17.4-DIN 10.65,42.35 11.1,41.9 11.1,40 11.5,39.6 13.4,39.6 LED16.2-DOUT
N$11
  Top 0.305: LED4.2-DOUT 4.95,33.45 3.6,34.8 3.6,36 3.4,36.2 1.3,36.2 LED5.4-DIN
N$12
  Top 0.305: LED5.2-DOUT 5.05,39.45 3.6,40.9 3.6,41.9 3.2,42.3 1.3,42.3 LED6.4-DIN
N$13
  Top 0.305: LED6.2-DOUT 4.85,45.65 3.6,46.9 3.6,48.1 3.5,48.2 1.3,48.2 LED7.4-DIN
N$14
  Top 0.305: LED7.2-DOUT 4.95,51.55 3.6,52.9 3.6,53.8 3.3,54.1 1.3,54.1 LED8.4-DIN
N$15
  Top 0.305: LED8.2-DOUT 4.85,57.65 3.6,58.8 3.6,59.6 3.1,60.1 1.3,60.1 LED9.4-DIN
N$16
  Top 0.305: LED9.2-DOUT 4.95,63.65 3.5,64.9 3.5,65.9 3.3,66.1 1.3,66.1 LED10.4-DIN
N$17
  Top 0.305: LED10.2-DOUT 4.85,69.45 3.5,70.8 3.5,71.7 3,72.2 1.3,72.2 LED11.4-DIN
N$18
  Top 0.305: LED18.4-DIN 10.55,48.35 11,47.9 11,46.1 11.5,45.6 13.4,45.6 LED17.2-DOUT
N$19
  Top 0.305: LED19.4-DIN 10.45,54.35 11,53.8 11,51.9 11.3,51.6 13.4,51.6 LED18.2-DOUT
N$20
  Top 0.305: LED20.4-DIN 10.55,60.35 11.1,59.8 11.1,58 11.4,57.7 13.4,57.7 LED19.2-DOUT
N$21
  Top 0.305: LED21.4-DIN 10.65,66.35 11.1,65.9 11.1,64.2 11.6,63.7 13.4,63.7 LED20.2-DOUT
N$22
  Top 0.305: LED22.4-DIN 10.65,72.25 11.1,71.8 11.1,70.1 11.5,69.7 13.4,69.7 LED21.2-DOUT
N$24  (via drill 0.6)
  Top 0.305: 15.95,12.55 LED23.4-DIN 15.9,12.4 v15.9,13.1 | LED22.2-DOUT 13.6,75.5 13.6,74.8 14.3,74.1 v15.9,74.1
  Bottom 0.305: v15.9,74.1 v15.9,13.1
N$25
  Top 0.305: LED23.2-DOUT 18.75,15.65 18.3,16.1 18.3,18 18,18.3 15.9,18.3 LED24.4-DIN
N$26
  Top 0.305: LED25.4-DIN 18.05,24.35 18.4,24 18.4,22.1 18.8,21.7 20.7,21.7 LED24.2-DOUT
N$27
  Top 0.305: LED26.4-DIN 17.85,30.35 18.3,29.9 18.3,28 18.7,27.6 20.7,27.6 LED25.2-DOUT
N$28
  Top 0.305: LED27.4-DIN 18.05,36.35 18.4,36 18.4,34.1 18.8,33.7 20.7,33.7 LED26.2-DOUT
N$29
  Top 0.305: LED28.4-DIN 17.95,42.35 18.3,42 18.3,40 18.7,39.6 20.7,39.6 LED27.2-DOUT
N$30
  Top 0.305: LED29.4-DIN 17.85,48.35 18.3,47.9 18.3,46 18.7,45.6 20.7,45.6 LED28.2-DOUT
N$31
  Top 0.406: LED30.4-DIN 18.35,54.35 19.2,53.5 19.2,51.9 19.5,51.6 20.7,51.6 LED29.2-DOUT
N$32
  Top 0.305: LED31.4-DIN 17.95,60.35 18.4,59.9 18.4,58 18.7,57.7 20.7,57.7 LED30.2-DOUT
N$33
  Top 0.305: LED32.4-DIN 17.85,66.35 18.3,65.9 18.3,64 18.7,63.6 20.7,63.6 LED31.2-DOUT
N$34
  Top 0.305: LED33.4-DIN 17.95,72.25 18.4,71.8 18.4,70 18.7,69.7 20.7,69.7 LED32.2-DOUT
N$35  (via drill 0.6)
  Top 0.305: LED33.2-DOUT 20.75,75.05 21.8,74 v23.2,74 | v23.2,13.3 23.3,12.4 LED34.4-DIN
  Bottom 0.305: v23.2,74 v23.2,13.3
N$37
  Top 0.305: LED35.4-DIN 25.55,18.35 26,17.9 26,16.1 26.4,15.7 28.1,15.7 LED34.2-DOUT
N$38
  Top 0.305: LED36.4-DIN 25.05,24.35 25.7,23.7 25.7,22.1 26.1,21.7 28.1,21.7 LED35.2-DOUT
N$39
  Top 0.305: LED37.4-DIN 25.05,30.35 25.6,29.8 25.6,28.1 26.1,27.6 28.1,27.6 LED36.2-DOUT
N$40
  Top 0.305: LED38.4-DIN 25.05,36.35 25.6,35.8 25.6,34.2 26.1,33.7 28.1,33.7 LED37.2-DOUT
N$41
  Top 0.305: LED39.4-DIN 25.25,42.35 25.7,41.9 25.7,40.1 26.1,39.7 28.1,39.7 LED38.2-DOUT
N$42
  Top 0.305: LED40.4-DIN 25.15,48.35 25.6,47.9 25.6,46.1 26,45.7 28.1,45.7 LED39.2-DOUT
N$43
  Top 0.305: LED41.4-DIN 25.15,54.35 25.6,53.9 25.6,52.1 26,51.7 28.1,51.7 LED40.2-DOUT
N$44
  Top 0.305: LED42.4-DIN 25.25,60.35 25.7,59.9 25.7,58 26.1,57.6 28.1,57.6 LED41.2-DOUT
N$45
  Top 0.305: LED43.4-DIN 25.25,66.35 25.7,65.9 25.7,63.9 26,63.6 28.1,63.6 LED42.2-DOUT
N$46
  Top 0.305: LED44.4-DIN 25.25,72.25 25.6,71.9 25.6,70.1 26,69.7 28.1,69.7 LED43.2-DOUT
N$49  (via drill 0.6)
  Top 0.305: 30.55,12.65 LED45.4-DIN 30.3,12.6 v30.3,13.3 | LED44.2-DOUT 28.15,75.25 29.4,74 v30.3,74
  Bottom 0.305: v30.3,74 30.3,67.3 29.5,66.5 29.5,61.8 30.3,60.7 v30.3,13.3
N$50
  Top 0.305: LED46.4-DIN 32.55,18.35 33,17.9 33,15.9 33.3,15.6 35.4,15.6 LED45.2-DOUT
N$51
  Top 0.305: LED47.4-DIN 32.55,24.35 32.9,24 32.9,22 33.3,21.6 35.4,21.6 LED46.2-DOUT
N$52
  Top 0.305: LED48.4-DIN 32.45,30.35 32.9,29.9 32.9,28 33.3,27.6 35.4,27.6 LED47.2-DOUT
N$53
  Top 0.305: LED49.4-DIN 32.45,36.35 33,35.8 33,33.9 33.2,33.7 35.4,33.7 LED48.2-DOUT
N$54
  Top 0.305: LED50.4-DIN 32.45,42.35 32.9,41.9 32.9,40.1 33.3,39.7 35.4,39.7 LED49.2-DOUT
N$55
  Top 0.305: LED51.4-DIN 32.45,48.35 32.9,47.9 32.9,46.1 33.3,45.7 35.4,45.7 LED50.2-DOUT
N$56
  Top 0.305: LED52.4-DIN 32.55,54.35 33,53.9 33,52.1 33.4,51.7 35.4,51.7 LED51.2-DOUT
N$57
  Top 0.305: LED53.4-DIN 32.45,60.35 32.9,59.9 32.9,58.2 33.4,57.7 35.4,57.7 LED52.2-DOUT
N$58
  Top 0.305: LED54.4-DIN 32.45,66.35 32.9,65.9 32.9,64.1 33.3,63.7 35.4,63.7 LED53.2-DOUT
N$59
  Top 0.305: LED55.4-DIN 32.45,72.25 33,71.7 33,70 33.3,69.7 35.4,69.7 LED54.2-DOUT
N$61  (via drill 0.6)
  Top 0.305: 37.7,12.5 37.8,12.4 | v37.8,13.2 37.8,12.4 | 37.8,12.4 LED56.4-DIN | LED55.2-DOUT 35.45,74.25 35.9,73.8 39.7,73.8 v40.8,72.5
  Bottom 0.305: v40.8,72.5 40.8,67.9 42.6,66.5 42.6,14.3 41.5,13.2 v37.8,13.2
N$62
  Top 0.305: LED57.4-DIN 39.75,18.35 40.3,17.8 40.3,16 40.7,15.6 42.7,15.6 LED56.2-DOUT
N$63
  Top 0.305: LED58.4-DIN 39.75,24.35 40.3,23.8 40.3,22.1 40.7,21.7 42.7,21.7 LED57.2-DOUT
N$64
  Top 0.305: LED59.4-DIN 39.75,30.35 40.2,29.9 40.2,28.2 40.7,27.7 42.7,27.7 LED58.2-DOUT
N$65
  Top 0.305: LED60.4-DIN 39.85,36.35 40.3,35.9 40.3,34.1 40.7,33.7 42.7,33.7 LED59.2-DOUT
N$66
  Top 0.305: LED61.4-DIN 39.25,42.35 39.8,41.8 39.8,40.8 40.6,39.8 42.6,39.8 LED60.2-DOUT
N$67
  Top 0.305: LED62.4-DIN 39.75,48.35 40.2,47.9 40.2,46.2 40.7,45.7 42.7,45.7 LED61.2-DOUT
N$68
  Top 0.305: LED63.4-DIN 40.05,54.35 40.8,53.6 40.8,52 41.2,51.6 42.7,51.6 LED62.2-DOUT
N$69
  Top 0.305: LED64.4-DIN 39.75,60.35 40.2,59.9 40.2,58.2 40.7,57.7 42.7,57.7 LED63.2-DOUT
N$70
  Top 0.305: LED65.4-DIN 39.85,66.35 40.3,65.9 40.3,64.2 40.8,63.7 42.7,63.7 LED64.2-DOUT
N$71
  Top 0.305: LED66.4-DIN 39.25,72.25 39.7,71.8 39.7,70.3 40.3,69.7 42.7,69.7 LED65.2-DOUT

### Text on the board
Top: PiBlade Mc RGB PiFace
bNames: http://github.com/ThingySticks/PiBlade | Gnd | DOUT | +5V | OUT | +5V | IN | DIN | Gnd